# Altium schematic sheet Sheet7.SchDoc
size A4; Organization: Altium Limited; Address1: L3, 12a Rodborough Rd; Address2: Frenchs Forest; Address3: NSW; Address4: Australia 2086
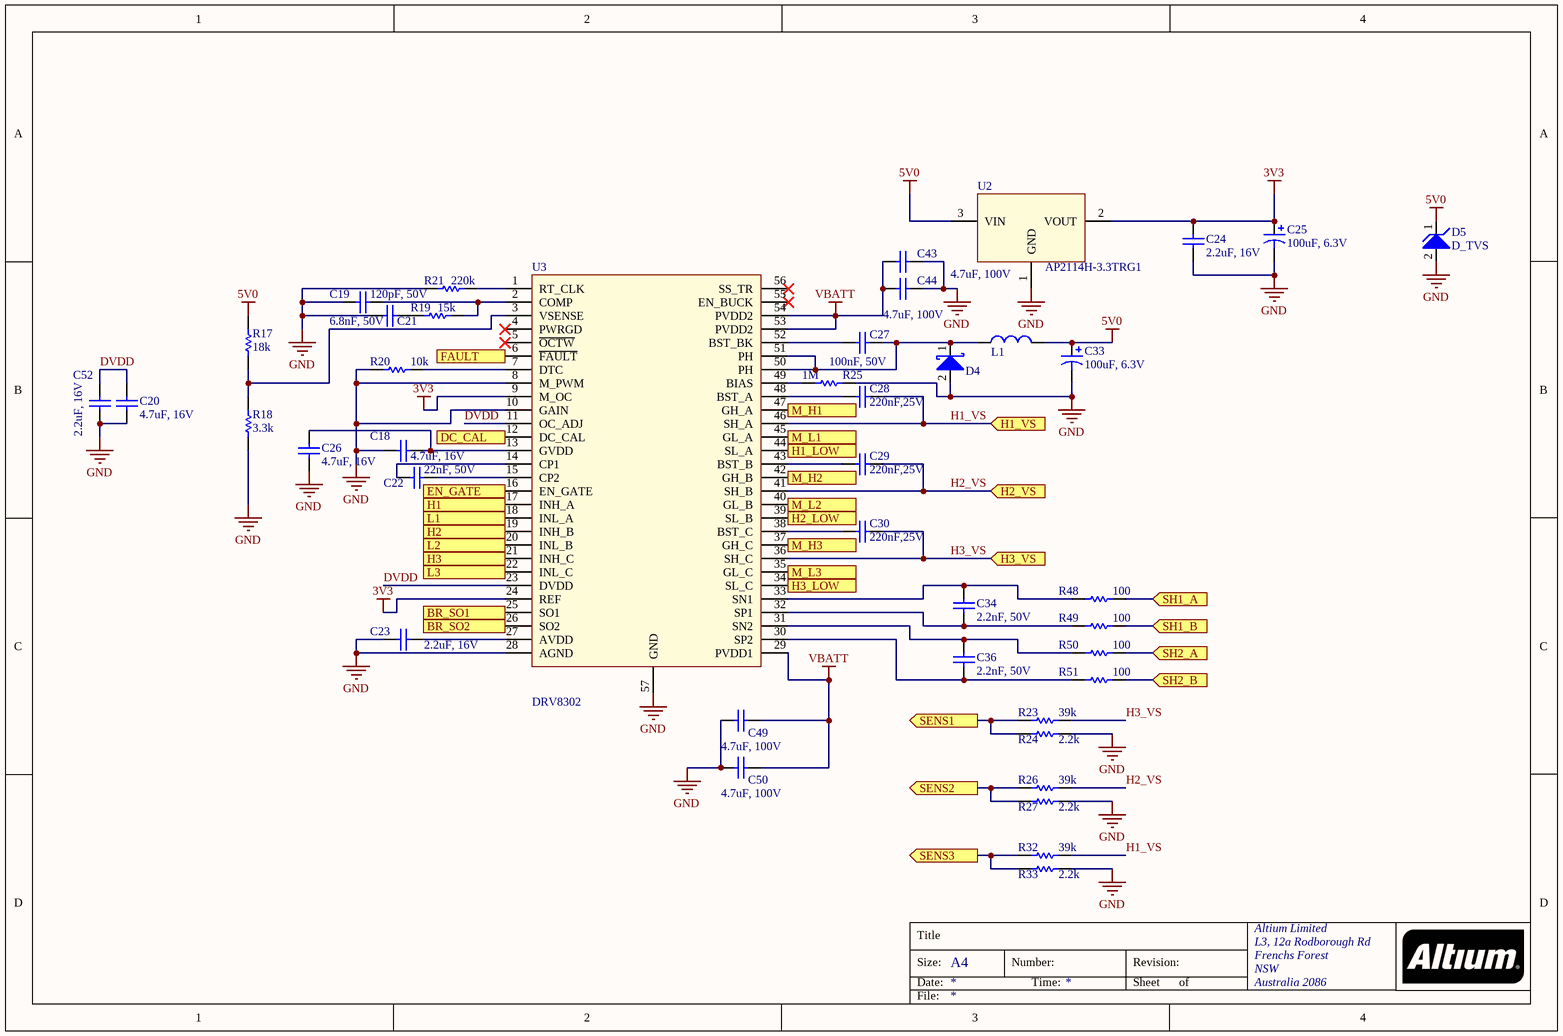
[diagram p0: Sheet7.SchDoc]

## Parts
C18  value 4.7uF, 16V  [SMD-0603 Capacitor]  (hidden comment: CAP)
C19  value 120pF, 50V  [SMD-0603 Capacitor]  (hidden comment: CAP)
C20  value 4.7uF, 16V  [SMD-0603 Capacitor]  (hidden comment: CAP)
C21  value 6.8nF, 50V  [SMD-0603 Capacitor]  (hidden comment: CAP)
C22  value 22nF, 50V  [SMD-0603 Capacitor]  (hidden comment: CAP)
C23  value 2.2uF, 16V  [SMD-0603 Capacitor]  (hidden comment: Voltage important)
C24  value 2.2uF, 16V  [SMD-0603 Capacitor]  (hidden comment: Voltage important)
C25  value 100uF, 6.3V  [TANT B]  (hidden comment: Voltage important)
C26  value 4.7uF, 16V  [SMD-0603 Capacitor]  (hidden comment: CAP)
C27  value 100nF, 50V  [SMD-0603 Capacitor]  (hidden comment: Voltage important)
C28  value 220nF,25V  [SMD-0603 Capacitor]  (hidden comment: Voltage important)
C29  value 220nF,25V  [SMD-0603 Capacitor]  (hidden comment: Voltage important)
C30  value 220nF,25V  [SMD-0603 Capacitor]  (hidden comment: Voltage important)
C33  value 100uF, 6.3V  [TANT B]  (hidden comment: Voltage important)
C34  value 2.2nF, 50V  [SMD-0603 Capacitor]  (hidden comment: CAP)
C36  value 2.2nF, 50V  [SMD-0603 Capacitor]  (hidden comment: CAP)
C43  value 4.7uF, 100V  [SMD-1206 Capacitor]  (hidden comment: CAP)
C44  value 4.7uF, 100V  [SMD-1206 Capacitor]  (hidden comment: CAP)
C49  value 4.7uF, 100V  [SMD-1206 Capacitor]  (hidden comment: CAP)
C50  value 4.7uF, 100V  [SMD-1206 Capacitor]  (hidden comment: CAP)
C52  value 2.2uF, 16V  [SMD-0603 Capacitor]  (hidden comment: Voltage important)
D4  Voltage and current important  [SOD-123W]  (value not drawn)
D5  D_TVS  [DO-214AC]
L1  COIL  [HCM0503]  (value not drawn)
R17  18k  [SMD-0603 Resistor]
R18  3.3k  [SMD-0603 Resistor]
R19  15k  [SMD-0603 Resistor]
R20  10k  [SMD-0603 Resistor]
R21  220k  [SMD-0603 Resistor]
R23  39k  [SMD-0603 Resistor]
R24  2.2k  [SMD-0603 Resistor]
R25  1M  [SMD-0603 Resistor]
R26  39k  [SMD-0603 Resistor]
R27  2.2k  [SMD-0603 Resistor]
R32  39k  [SMD-0603 Resistor]
R33  2.2k  [SMD-0603 Resistor]
R48  100  [SMD-0603 Resistor]
R49  100  [SMD-0603 Resistor]
R50  100  [SMD-0603 Resistor]
R51  100  [SMD-0603 Resistor]
U2  Manufacturer Part Number: AP2114H-3.3TRG1  [SOT230P700X180-4N]  (hidden comment: 3.3V)
U3  DRV8302  [SOP127P600-8N]

## Ports
BR_SO1 (out), BR_SO2 (out), DC_CAL (in), EN_GATE (in), FAULT (out), H1 (in), H1_LOW (in), H1_VS (in), H2 (in), H2_LOW (in), H2_VS (in), H3 (in), H3_LOW (in), H3_VS (in), L1 (in), L2 (in), L3 (in), M_H1 (out), M_H2 (out), M_H3 (out), M_L1 (out), M_L2 (out), M_L3 (out), SENS1 (out), SENS2 (out), SENS3 (out), SH1_A (in), SH1_B (in), SH2_A (in), SH2_B (in)

## Nets
3V3: C24.2 C25.1 U2.2(VOUT) U3.9(M_OC) U3.24(REF)
5V0: C33.1 D5.1(K) L1.2 R17.2 U2.3(VIN)
GND: C18.2 C19.1 C20.1 C21.1 C23.1 C24.1 C25.2 C26.1 C33.2 C43.1 C44.1 C49.2 C50.2 C52.1 D4.2(A) D5.2(A) R18.1 R20.1 R21.1 R24.2 R25.2 R27.2 R33.2 U2.1(GND) U3.8(M_PWM) U3.10(GAIN) U3.28(AGND) U3.57(GND)
VBATT: C43.2 C44.2 C49.1 C50.1 U3.29(PVDD1) U3.53(PVDD2) U3.54(PVDD2)
BR_SO1: U3.25(SO1) ; port BR_SO1
BR_SO2: U3.26(SO2) ; port BR_SO2
DC_CAL: U3.12(DC_CAL) ; port DC_CAL
DVDD: C20.2 C52.2 U3.11(OC_ADJ) U3.23(DVDD)
EN_GATE: U3.16(EN_GATE) ; port EN_GATE
FAULT: U3.6(~{FAULT}) ; port FAULT
H1: U3.17(INH_A) ; port H1
H1_LOW: U3.44(SL_A) ; port H1_LOW
H1_VS: C28.2 R32.2 U3.46(SH_A) ; port H1_VS
H2: U3.19(INH_B) ; port H2
H2_LOW: U3.39(SL_B) ; port H2_LOW
H2_VS: C29.2 R26.2 U3.41(SH_B) ; port H2_VS
H3: U3.21(INH_C) ; port H3
H3_LOW: U3.34(SL_C) ; port H3_LOW
H3_VS: C30.2 R23.2 U3.36(SH_C) ; port H3_VS
L1: U3.18(INL_A) ; port L1
L2: U3.20(INL_B) ; port L2
L3: U3.22(INL_C) ; port L3
M_H1: U3.47(GH_A) ; port M_H1
M_H2: U3.42(GH_B) ; port M_H2
M_H3: U3.37(GH_C) ; port M_H3
M_L1: U3.45(GL_A) ; port M_L1
M_L2: U3.40(GL_B) ; port M_L2
M_L3: U3.35(GL_C) ; port M_L3
SENS1: R23.1 R24.1 ; port SENS1
SENS2: R26.1 R27.1 ; port SENS2
SENS3: R32.1 R33.1 ; port SENS3
SH1_A: R48.2 ; port SH1_A
SH1_B: R49.2 ; port SH1_B
SH2_A: R50.2 ; port SH2_A
SH2_B: R51.2 ; port SH2_B
NetC18_1: C18.1 C26.2 U3.13(GVDD)
NetC19_2: C19.2 R19.2 U3.2(COMP)
NetC21_2: C21.2 R19.1
NetC22_1: C22.1 U3.14(CP1)
NetC22_2: C22.2 U3.15(CP2)
NetC23_2: C23.2 U3.27(AVDD)
NetC27_1: C27.1 U3.52(BST_BK)
NetC27_2: C27.2 D4.1(K) L1.1 U3.50(PH) U3.51(PH)
NetC28_1: C28.1 U3.48(BST_A)
NetC29_1: C29.1 U3.43(BST_B)
NetC30_1: C30.1 U3.38(BST_C)
NetC34_1: C34.1 R49.1 U3.32(SP1)
NetC34_2: C34.2 R48.1 U3.33(SN1)
NetC36_1: C36.1 R51.1 U3.30(SP2)
NetC36_2: C36.2 R50.1 U3.31(SN2)
NetR17_1: R17.1 R18.2 U3.3(VSENSE)
NetR20_2: R20.2 U3.7(DTC)
NetR21_2: R21.2 U3.1(RT_CLK)
NetR25_1: R25.1 U3.49(BIAS)

Not connected (* = marked no-connect by the designer): U3 4(PWRGD)* 5(~{OCTW})* 55(EN_BUCK)* 56(SS_TR)*

## Notes on the sheet
- Title
- Size:
- Date:
- A4
- Number:
- Time:
- Revision:
- Sheet
- of
- File:

## Library data of the parts
C18 C20 C26 = 25: CAP 4.7u, 16V, 0603; Manufacturer Part Number: C1608X6S1C475K080AC; Manufacturer: TDK Corporation; ID: 25; Place (YES/NO): YES
C19 = 4: CAP 120p, 50V, 0603; Manufacturer Part Number: GRM39C121J50; Manufacturer: Murata Electronics North America; ID: 4; Place (YES/NO): YES
C21 = 5: CAP 6.8n, 50V, 0603; Manufacturer Part Number: GRM18R71H682KA01J; Manufacturer: Murata Electronics North America; ID: 5; Place (YES/NO): YES
C22 = 6: CAP 22n, 50V, 0603; Manufacturer Part Number: GRM18F51H223ZA01D; Manufacturer: Murata Electronics North America; ID: 6; Place (YES/NO): YES
C23 C24 C52 = 9: CAP 2.2u, 16V, 0603; Manufacturer Part Number: C1608X5R1C225M; Manufacturer: TDK Corporation; ID: 9; Place (YES/NO): YES
C25 C33 = 12: CAP 100u, 6.3V; Manufacturer Part Number: TPSB107K006R0400; Manufacturer: AVX Corporation; ID: 12; Place (YES/NO): YES
C27 = 7: CAP 100n, 50V, 0603; Manufacturer Part Number: 06035C104JAT2A; Manufacturer: AVX Corporation; ID: 7; Place (YES/NO): YES
C28-C30 = 8: CAP 220n, 25V, 0603; Manufacturer Part Number: TMK107B7224KA-T; Manufacturer: Taiyo Yuden; ID: 8; Place (YES/NO): YES
C34 C36 = 2: CAP 2.2n, 50V, 0603; Manufacturer Part Number: GRM39X222J50D; Manufacturer: Murata Electronics North America; ID: 2; Place (YES/NO): YES
C43 C44 C49 C50 = 23: 4.7µF 100V Ceramic Capacitor X7S 1206; Manufacturer Part Number: 12061Z475MAT2A; Manufacturer: AVX Corporation; ID: 23; Place (YES/NO): YES
D4 = 4: Shottky 60V 2A; Manufacturer Part Number: PMEG6020ER-115; Manufacturer: NXP Semiconductors; ID: 4; Place (YES/NO): YES
D5 = 5: TVS diode 5V; Manufacturer Part Number: SMAJ5.0A; Manufacturer: Littelfuse Inc.; ID: 5; Place (YES/NO): YES; Value: 5V
L1 = 7: FIXED IND 22UH 1.9A 270 MOHM SMD; Manufacturer Part Number: HCM0503-220-R; Manufacturer: Eaton; ID: 7; Value: 22µH; Place (YES/NO): YES
R17 = 7: R 18k, 0603; Manufacturer Part Number: RK73H1JTTD1802F; Manufacturer: KOA Speer; ID: 7; Place (YES/NO): YES; Value: 18k
R18 = 4: R 3.3k, 0603; Manufacturer Part Number: RK73H1JTTD3301F; Manufacturer: KOA Speer; ID: 4; Place (YES/NO): YES; Value: 3.3k
R19 = 6: R 15k, 0603; Manufacturer Part Number: RK73H1JTTD1502F; Manufacturer: KOA Speer; ID: 6; Place (YES/NO): YES; Value: 15k
R20 = 5: R 10k, 0603; Manufacturer Part Number: RK73H1JTTD1002F; Manufacturer: KOA Speer; ID: 5; Place (YES/NO): YES; Value: 10k
R21 = 9: R 220k, 0603; Manufacturer Part Number: RK73H1JTTD2203F; Manufacturer: KOA Speer; ID: 9; Place (YES/NO): YES; Value: 220k
R23 R26 R32 = 8: R 39k, 0603; Manufacturer Part Number: ERJ-3EKF3902V; Manufacturer: Panasonic Electronic Components; ID: 8; Place (YES/NO): YES; Value: 39k
R24 R27 R33 = 3: R 2.2k, 0603; Manufacturer Part Number: RK73H1JTTD2201F; Manufacturer: KOA Speer; ID: 3; Place (YES/NO): YES; Value: 2.2k
R25 = 11: R 1M, 0603; Manufacturer Part Number: RK73H1JTTD1004F; Manufacturer: KOA Speer; ID: 11; Place (YES/NO): YES; Value: 1M
R48-R51 = 2: R 100ohm, 0603; Manufacturer Part Number: RK73H1JTTD1000F; Manufacturer: KOA Speer; ID: 2; Place (YES/NO): YES; Value: 100
U2 = 3: VREG LDO; Manufacturer: Diodes Incorporated; ID: 3; Place (YES/NO): YES; Value: 3.3V
U3 = 2: MOSFET Driver; Manufacturer Part Number: DRV8302DCA; Manufacturer: Texas Instruments; ID: 2; Place (YES/NO): YES; Value: MOSFET Driver